# Altium schematic sheet 客厅白色灯带控制器.SchDoc
size A4
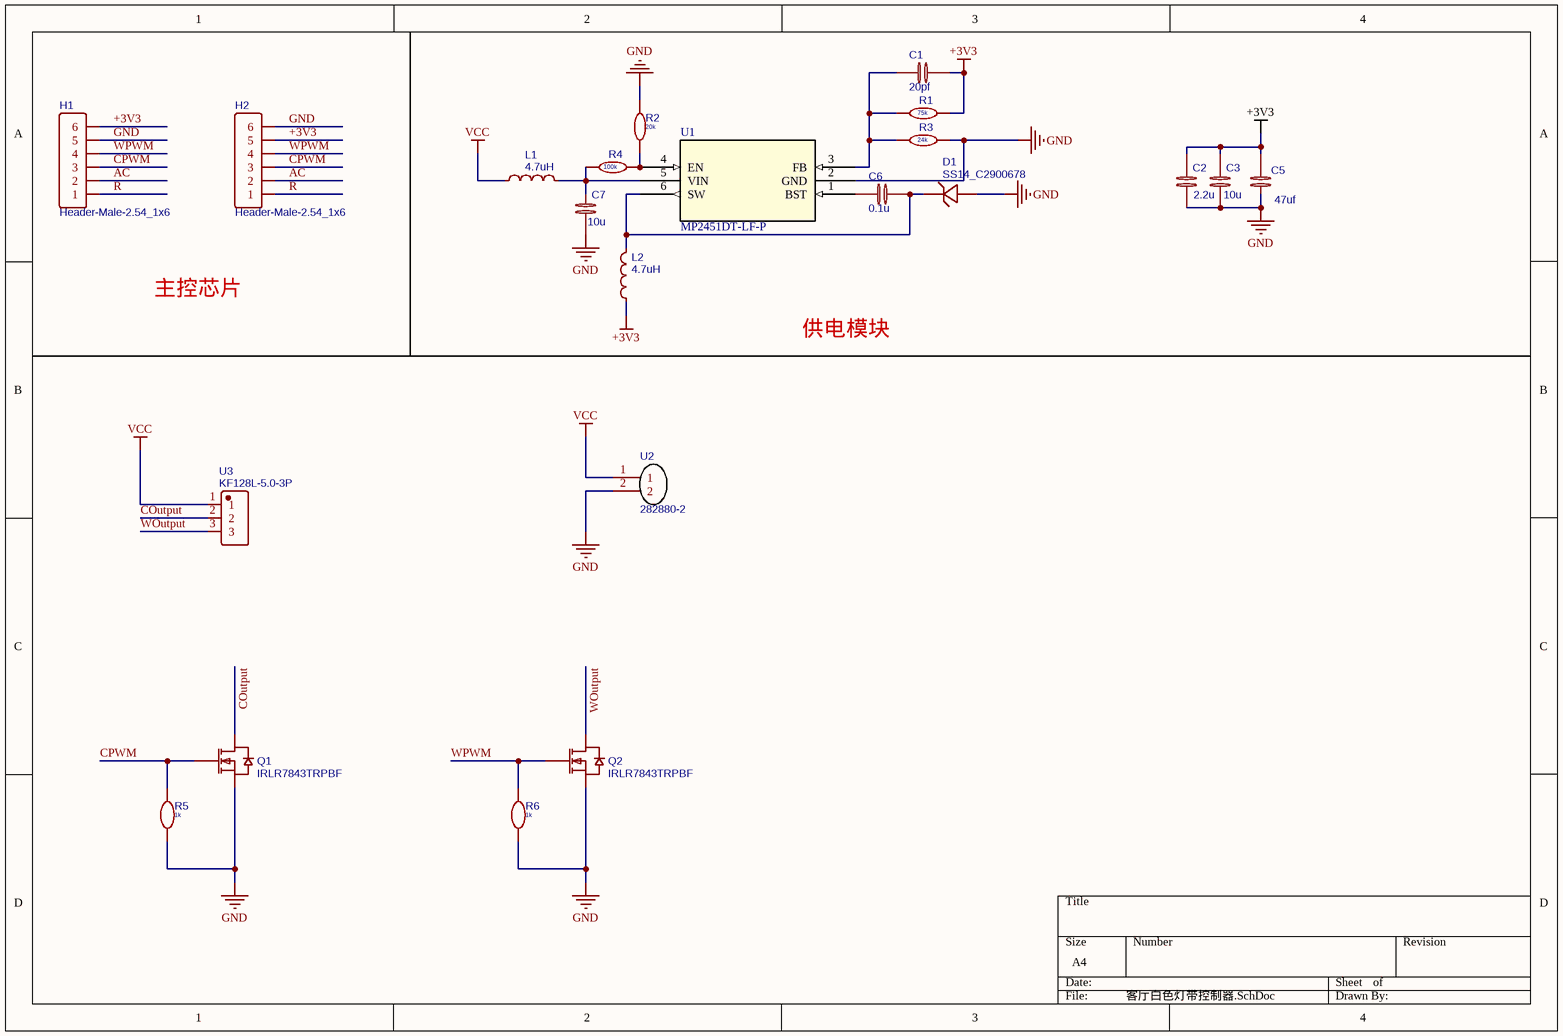
[diagram p0: 客厅白色灯带控制器.SchDoc]

## Parts
C1  20pf  [C0603]
C2  2.2u  [C0603]
C3  10u  [C0603]
C5  47uf  [C0603]
C6  0.1u  [C0603]
C7  10u  [C0603]
D1  SS14_C2900678  [SMA_L4.3-W2.5-LS5.0-RD-1]
H1  Header-Male-2.54_1x6  [HDR-TH_6P-P2.54-V-M-1]
H2  Header-Male-2.54_1x6  [HDR-TH_6P-P2.54-V-M-1]
L1  4.7uH  [L1008]
L2  4.7uH  [L1008]
Q1  IRLR7843TRPBF  [TO-252-2_L6.5-W6.1-P4.58-LS10.0-TR]
Q2  IRLR7843TRPBF  [TO-252-2_L6.5-W6.1-P4.58-LS10.0-TR]
R1  75k  [R0603]
R2  20k  [R0603]
R3  24k  [R0603]
R4  100k  [R0603]
R5  1k  [R0603]
R6  1k  [R0603]
U1  MP2451DT-LF-P  [SOT-23-6_L2.9-W1.6-P0.95-LS2.8-BR]
U2  282880-2  [CONN-TH_2P-P5.00_282880-2]
U3  KF128L-5.0-3P  [CONN-TH_3P-P5.00_KF128L-5.0-3P]

## Nets
+3V3: C1.2 C2.2 C3.2 C5.2 H1.6 H2.5 L2.1 R1.1
GND: C2.1 C3.1 C5.1 C7.1 D1.2(A) H1.5 H2.6 Q1.3(S) Q2.3(S) R2.1 R3.1 R5.2 R6.2 U1.2(GND) U2.2
VCC: L1.1 U2.1 U3.1
AC: H1.2 H2.2
COutput: Q1.4(D) U3.2
CPWM: H1.3 H2.3 Q1.1(G) R5.1
R: H1.1 H2.1
WOutput: Q2.4(D) U3.3
WPWM: H1.4 H2.4 Q2.1(G) R6.1
NetC1_1: C1.1 R1.2 R3.2 U1.3(FB)
NetC6_1: C6.1 U1.1(BST)
NetC6_2: C6.2 D1.1(C) L2.2 U1.6(SW)
NetC7_2: C7.2 L1.2 R4.2 U1.5(VIN)
NetR2_2: R2.2 R4.1 U1.4(EN)

## Notes on the sheet
- 主控芯片
- 供电模块

## Library data of the parts
C1 C5-C7 = 0.1u: nameAlias: Value(F); Contributor: LCEDA_Lib; spicePre: C; spiceSymbolName: C_0603_EU
C2 = 2.2u: nameAlias: Value(F); Contributor: LCEDA_Lib; spicePre: C; spiceSymbolName: C_0603_EU
C3 = 10u: nameAlias: Value(F); Contributor: LCEDA_Lib; spicePre: C; spiceSymbolName: C_0603_EU
D1 = SS14_C2900678: BOM_Manufacturer: BLUE ROCKET(蓝箭); BOM_Manufacturer Part: SS14; Contributor: LCSC; BOM_Supplier: LCSC; BOM_Supplier Part: C2900678; spicePre: D; spiceSymbolName: SS14_C2900678
H1 H2 = Header-Male-2.54_1x6: BOM_Manufacturer: BOOMELE; BOM_Supplier: LCSC; BOM_Manufacturer Part: Header-Male-2.54_1x6; BOM_Supplier Part: C37208; BOM_JLCPCB Part Class: Extended Part; spicePre: H; spiceSymbolName: Header-Male-2.54_1x6
L1 L2 = 4.7uH: BOM_Manufacturer: SXN; BOM_Manufacturer Part: SMMS0630-4R7M; nameAlias: Inductance; BOM_Supplier: LCSC; BOM_Supplier Part: C128688; BOM_JLCPCB Part Class: Extended Part; spicePre: L; spiceSymbolName: SMMS0630-4R7M
Q1 Q2 = IRLR7843TRPBF: BOM_Manufacturer: IR; BOM_Supplier: LCSC; BOM_Manufacturer Part: IRLR7843TRPBF; BOM_Supplier Part: C21988; BOM_JLCPCB Part Class: Extended Part; spicePre: Q; spiceSymbolName: IRLR7843TRPBF
R1-R4 = 10k: BOM_Manufacturer Part: CRCW060310K0JNEA; BOM_Manufacturer: Vishay Intertech; nameAlias: Value(Ω); spicePre: R; spiceSymbolName: Resistor; BOM_Supplier: LCSC; BOM_Supplier Part: C169103
R5 R6 = NC: nameAlias: Value(Ω); Contributor: LCEDA_Lib; spicePre: R; spiceSymbolName: R_0603_EU
U1 = MP2451DT-LF-P: No Description Available; Mfr_Name: Monolithic Power Systems; Copyright: Copyright (C) 2022 Ultra Librarian. All rights reserved.; Manufacturer_Part_Number: MP2451DT-LF-P; RefDes: RefDes; Type: DEV
U2 = 282880-2: BOM_Manufacturer: TE Connectivity; Contributor: LCSC; BOM_Supplier: LCSC; BOM_Supplier Part: C306188; BOM_Manufacturer Part: 282880-2; BOM_JLCPCB Part Class: Extended Part; spicePre: U; spiceSymbolName: 282880-2
U3 = KF128L-5.0-3P: BOM_Manufacturer: Cixi Kefa Elec; Contributor: LCSC; BOM_Supplier: LCSC; BOM_Supplier Part: C474939; BOM_Manufacturer Part: KF128L-5.0-3P; BOM_JLCPCB Part Class: Extended Part; spicePre: U; spiceSymbolName: KF128L-5.0-3P